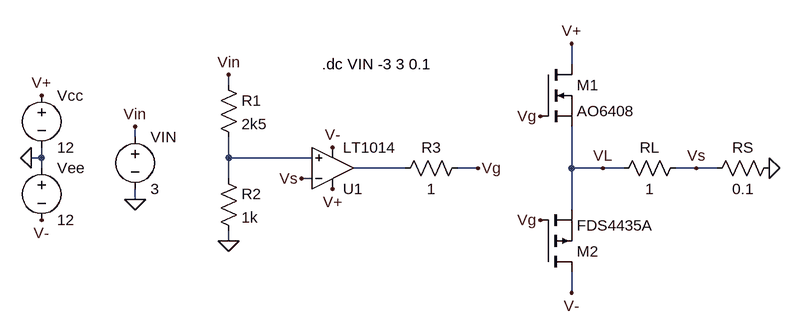
[diagram p0: schematic AmpOpDriverBipolar_v3.asc]
AmpOpDriverBipolar_v3.asc, the LTspice schematic file:
Version 4
SHEET 1 880 680
WIRE 128 -16 128 -48
WIRE -400 16 -400 0
WIRE -544 96 -544 80
WIRE -688 128 -688 112
WIRE -688 128 -704 128
WIRE -400 128 -400 96
WIRE -272 128 -400 128
WIRE -688 144 -688 128
WIRE -128 144 -208 144
WIRE -16 144 -48 144
WIRE 128 144 128 80
WIRE 176 144 128 144
WIRE 208 144 176 144
WIRE 320 144 288 144
WIRE 352 144 320 144
WIRE -400 160 -400 128
WIRE -272 160 -288 160
WIRE -544 192 -544 176
WIRE 128 208 128 144
WIRE -400 256 -400 240
WIRE 128 336 128 304
FLAG 432 144 0
FLAG 128 -48 V+
FLAG -16 144 Vg
FLAG 80 64 Vg
FLAG -704 128 0
FLAG -688 32 V+
FLAG -240 176 V+
FLAG -688 224 V-
FLAG -544 192 0
FLAG -240 112 V-
FLAG 128 336 V-
FLAG 176 144 VL
FLAG 320 144 Vs
FLAG 80 224 Vg
FLAG -288 160 Vs
FLAG -544 80 Vin
FLAG -400 256 0
FLAG -400 0 Vin
SYMBOL res 192 160 R270
WINDOW 0 32 56 VTop 2
WINDOW 3 0 56 VBottom 2
SYMATTR InstName RL
SYMATTR Value 1
SYMBOL res 336 160 R270
WINDOW 0 32 56 VTop 2
WINDOW 3 0 56 VBottom 2
SYMATTR InstName RS
SYMATTR Value 0.1
SYMBOL OpAmps\\LT1014 -240 208 M180
SYMATTR InstName U1
SYMBOL res -32 128 R90
WINDOW 0 0 56 VBottom 2
WINDOW 3 32 56 VTop 2
SYMATTR InstName R3
SYMATTR Value 1
SYMBOL voltage -544 80 R0
WINDOW 123 0 0 Left 0
WINDOW 39 0 0 Left 0
SYMATTR InstName VIN
SYMATTR Value 3
SYMBOL voltage -688 16 R0
WINDOW 123 0 0 Left 0
WINDOW 39 0 0 Left 0
SYMATTR InstName Vcc
SYMATTR Value 12
SYMBOL voltage -688 128 R0
WINDOW 123 0 0 Left 0
WINDOW 39 0 0 Left 0
SYMATTR InstName Vee
SYMATTR Value 12
SYMBOL nmos 80 -16 R0
SYMATTR InstName M1
SYMATTR Value AO6408
SYMBOL pmos 80 304 M180
SYMATTR InstName M2
SYMATTR Value FDS4435A
SYMBOL res -416 0 R0
SYMATTR InstName R1
SYMATTR Value 2k5
SYMBOL res -416 144 R0
SYMATTR InstName R2
SYMATTR Value 1k
TEXT -256 -16 Left 2 !.dc VIN -3 3 0.1

The netlist it stands for:
* AmpOpDriverBipolar_v3.asc
RL VL Vs 1
RS Vs 0 0.1
XU1 N001 Vs V+ V- N002 LT1014  ; pins In+ In- V+ V- OUT
R3 Vg N002 1
VIN Vin 0 3
Vcc V+ 0 12
Vee 0 V- 12
M1 V+ Vg VL VL AO6408
M2 V- Vg VL VL FDS4435A
R1 Vin N001 2k5
R2 N001 0 1k
.model NMOS NMOS
.model PMOS PMOS
.lib standard.mos
.dc VIN -3 3 0.1
.backanno
.end